# Altium schematic sheet Buttons.SchDoc
size A4
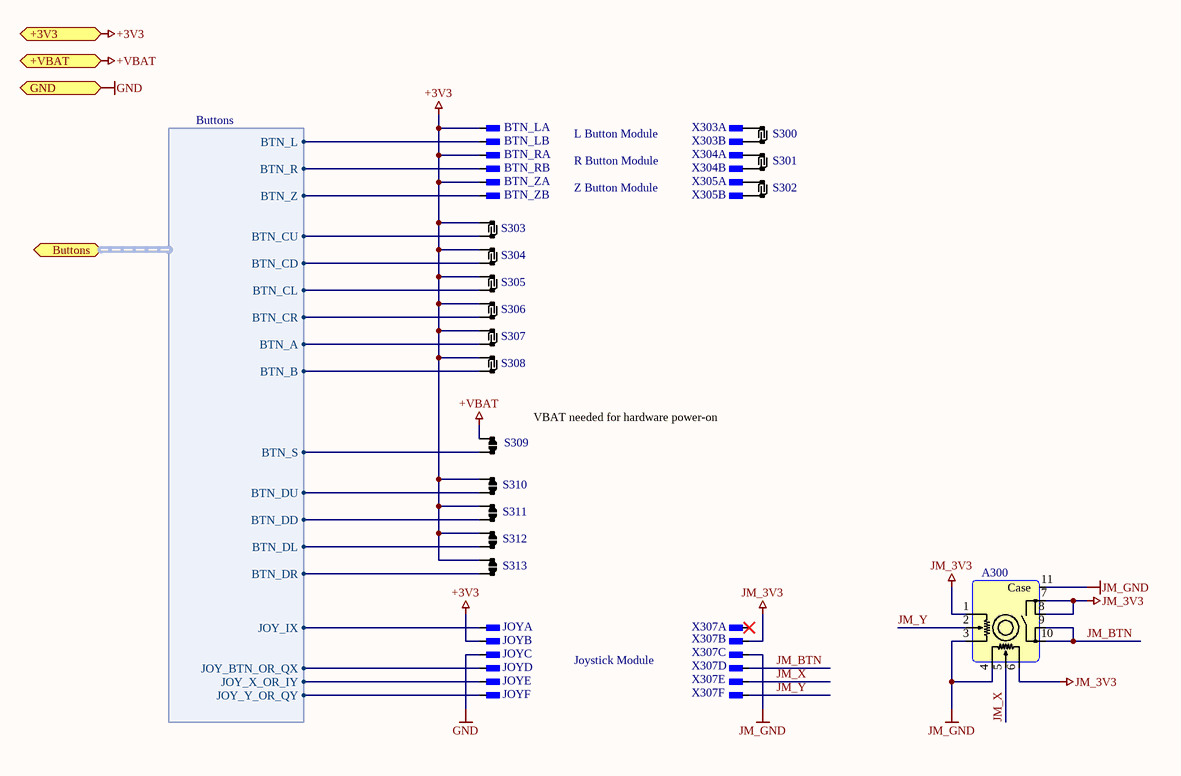
[diagram p0: Buttons.SchDoc]

## Parts
A300  A_JOYSTICK_MODULE_RKJXK122400Y  [A_JOYSTICK_MODULE_RKJXK122400Y]  (value not drawn)
BTN_L  X_CONNECTOR_P2.54_D0.9_1X2  [THT_CON_P2.54_D0.9_1X2]  (value not drawn)  (parts A,B of 2)
BTN_R  X_CONNECTOR_P2.54_D0.9_1X2  [THT_CON_P2.54_D0.9_1X2]  (value not drawn)  (parts A,B of 2)
BTN_Z  X_CONNECTOR_P2.54_D0.9_1X2  [THT_CON_P2.54_D0.9_1X2]  (value not drawn)  (parts A,B of 2)
JOY  X_CONNECTOR_P2.54_D0.9_2X3  [THT_CON_P2.54_D0.9_2X3]  (value not drawn)  (parts A,B,C,D,E,F of 6)
S300  S_N64_FINGER_CARBON_CONTACT  [SMD_N64_FINGER_CARBON_CONTACT]  (value not drawn)
S301  S_N64_FINGER_CARBON_CONTACT  [SMD_N64_FINGER_CARBON_CONTACT]  (value not drawn)
S302  S_N64_FINGER_CARBON_CONTACT  [SMD_N64_FINGER_CARBON_CONTACT]  (value not drawn)
S303  S_N64_FINGER_CARBON_CONTACT  [SMD_N64_FINGER_CARBON_CONTACT]  (value not drawn)
S304  S_N64_FINGER_CARBON_CONTACT  [SMD_N64_FINGER_CARBON_CONTACT]  (value not drawn)
S305  S_N64_FINGER_CARBON_CONTACT  [SMD_N64_FINGER_CARBON_CONTACT]  (value not drawn)
S306  S_N64_FINGER_CARBON_CONTACT  [SMD_N64_FINGER_CARBON_CONTACT]  (value not drawn)
S307  S_N64_FINGER_CARBON_CONTACT  [SMD_N64_FINGER_CARBON_CONTACT]  (value not drawn)
S308  S_N64_FINGER_CARBON_CONTACT  [SMD_N64_FINGER_CARBON_CONTACT]  (value not drawn)
S309  S_N64_START_CARBON_CONTACT  [SMD_N64_START_CARBON_CONTACT]  (value not drawn)
S310  S_N64_DPAD_CARBON_CONTACT  [SMD_N64_DPAD_CARBON_CONTACT]  (value not drawn)
S311  S_N64_DPAD_CARBON_CONTACT  [SMD_N64_DPAD_CARBON_CONTACT]  (value not drawn)
S312  S_N64_DPAD_CARBON_CONTACT  [SMD_N64_DPAD_CARBON_CONTACT]  (value not drawn)
S313  S_N64_DPAD_CARBON_CONTACT  [SMD_N64_DPAD_CARBON_CONTACT]  (value not drawn)
X303  X_CONNECTOR_P2.54_D0.9_1X2  [THT_CON_P2.54_D0.9_1X2]  (value not drawn)  (parts A,B of 2)
X304  X_CONNECTOR_P2.54_D0.9_1X2  [THT_CON_P2.54_D0.9_1X2]  (value not drawn)  (parts A,B of 2)
X305  X_CONNECTOR_P2.54_D0.9_1X2  [THT_CON_P2.54_D0.9_1X2]  (value not drawn)  (parts A,B of 2)
X307  X_CONNECTOR_P2.54_D0.9_2X3  [THT_CON_P2.54_D0.9_2X3]  (value not drawn)  (parts A,B,C,D,E,F of 6)

## Ports
+3V3, +VBAT, Buttons (harness Buttons), GND

## Harnesses
Buttons: BTN_A, BTN_B, BTN_CD, BTN_CL, BTN_CR, BTN_CU, BTN_DD, BTN_DL, BTN_DR, BTN_DU, JOY_Y_OR_QY, BTN_L, BTN_R, BTN_S, BTN_Z, JOY_IX, JOY_BTN_OR_QX, JOY_X_OR_IY

## Nets
+3V3: BTN_L.1 BTN_R.1 BTN_Z.1 JOY.2 S303.1 S304.1 S305.1 S306.1 S307.1 S308.1 S310.1 S311.1 S312.1 S313.1 ; port +3V3
+VBAT: S309.1 ; port +VBAT
GND: JOY.3 ; port GND
JM_3V3: A300.1(XV+) A300.6(YV-) A300.7(BTN+) A300.8(BTN+) X307.2
JM_GND: A300.3(XV-) A300.4(YV+) A300.11(Case) X307.3
JM_BTN: A300.9(BTN-) A300.10(BTN-) X307.4
JM_X: A300.5(Y) X307.5
JM_Y: A300.2(X) X307.6
NetBTN_L_2: BTN_L.2 ; port Buttons.BTN_L
NetBTN_R_2: BTN_R.2 ; port Buttons.BTN_R
NetBTN_Z_2: BTN_Z.2 ; port Buttons.BTN_Z
NetJOY_1: JOY.1 ; port Buttons.JOY_IX
NetJOY_4: JOY.4 ; port Buttons.JOY_BTN_OR_QX
NetJOY_5: JOY.5 ; port Buttons.JOY_X_OR_IY
NetJOY_6: JOY.6 ; port Buttons.JOY_Y_OR_QY
NetS300_1: S300.1 X303.1
NetS300_2: S300.2 X303.2
NetS301_1: S301.1 X304.1
NetS301_2: S301.2 X304.2
NetS302_1: S302.1 X305.1
NetS302_2: S302.2 X305.2
NetS303_2: S303.2 ; port Buttons.BTN_CU
NetS304_2: S304.2 ; port Buttons.BTN_CD
NetS305_2: S305.2 ; port Buttons.BTN_CL
NetS306_2: S306.2 ; port Buttons.BTN_CR
NetS307_2: S307.2 ; port Buttons.BTN_A
NetS308_2: S308.2 ; port Buttons.BTN_B
NetS309_2: S309.2 ; port Buttons.BTN_S
NetS310_2: S310.2 ; port Buttons.BTN_DU
NetS311_2: S311.2 ; port Buttons.BTN_DD
NetS312_2: S312.2 ; port Buttons.BTN_DL
NetS313_2: S313.2 ; port Buttons.BTN_DR

Not connected (* = marked no-connect by the designer): X307 1*

## Notes on the sheet
- L Button Module
- R Button Module
- Z Button Module
- VBAT needed for hardware power-on
- Joystick Module
- Title
- Size:
- Date:
- A4
- Number:
- Time:
- Revision:
- Sheet
- of
- File:

## Library data of the parts
BTN_L BTN_R BTN_Z X303-X305 = X_CONNECTOR_P2.54_D0.9_1X2: Pitch 2.54, Diameter 0.9mm, 1 row, 2 columns; Type: Pitch 2.54, Diameter 0.9mm, 1 row, 2 columns
JOY X307 = X_CONNECTOR_P2.54_D0.9_2X3: Pitch 2.54, Diameter 0.9mm, 2 row, 3 columns; Type: Pitch 2.54, Diameter 0.9mm, 2 row, 3 columns
S300-S308 = S_N64_FINGER_CARBON_CONTACT: N64 DPAD Carbon ink contact
S309 = S_N64_START_CARBON_CONTACT: N64 DPAD Carbon ink contact
S310-S313 = S_N64_DPAD_CARBON_CONTACT: N64 DPAD Carbon ink contact
A300 = A_JOYSTICK_MODULE_RKJXK122400Y: Type: RKJXK122400Y